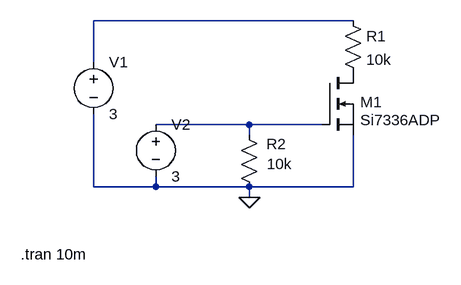
[diagram p0: schematic NMOS.asc]
NMOS.asc, the LTspice schematic file:
Version 4
SHEET 1 880 680
WIRE 464 -112 64 -112
WIRE 64 -48 64 -112
WIRE 304 48 160 48
WIRE 416 48 304 48
WIRE 304 64 304 48
WIRE 64 144 64 32
WIRE 160 144 160 128
WIRE 160 144 64 144
WIRE 304 144 160 144
WIRE 464 144 464 64
WIRE 464 144 304 144
WIRE 304 160 304 144
FLAG 304 160 0
SYMBOL voltage 64 -64 R0
SYMATTR InstName V1
SYMATTR Value 3
SYMBOL res 320 160 R180
WINDOW 0 -41 82 Left 2
WINDOW 3 -50 51 Left 2
SYMATTR InstName R2
SYMATTR Value 10k
SYMBOL nmos 416 -32 R0
WINDOW 0 59 45 Left 2
WINDOW 3 59 73 Left 2
SYMATTR InstName M1
SYMATTR Value Si7336ADP
SYMBOL voltage 160 32 R0
WINDOW 123 0 0 Left 0
WINDOW 39 0 0 Left 0
SYMATTR InstName V2
SYMATTR Value 3
SYMBOL res 448 -128 R0
SYMATTR InstName R1
SYMATTR Value 10k
TEXT -48 248 Left 2 !.tran 10m

The netlist it stands for:
* NMOS.asc
V1 N001 0 3
R2 0 N002 10k
M1 P001 N002 0 0 Si7336ADP
V2 N002 0 3
R1 N001 P001 10k
.model NMOS NMOS
.model PMOS PMOS
.lib standard.mos
.tran 10m
.backanno
.end